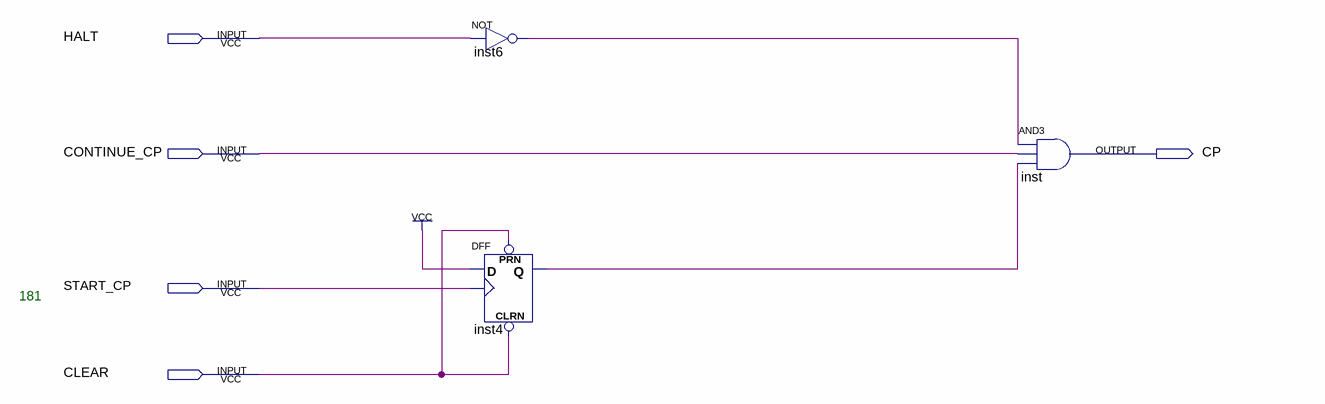
[diagram p0: schematic sheet]
// Quartus schematic start_and_stop.bdf as structural Verilog: 3 symbols, 5 pins
module start_and_stop (
  input  HALT,
  input  CONTINUE_CP,
  input  START_CP,
  input  CLEAR,
  output CP
);

  wire inst4_q, inst6_out;

  not inst6 (inst6_out, HALT);
  DFF inst4 (.CLRN(CLEAR), .CLK(START_CP), .D(1'b1), .PRN(CLEAR), .Q(inst4_q));
  and inst (CP, inst6_out, CONTINUE_CP, inst4_q);

  // Notes on the sheet:
  //   181
endmodule
